# Altium schematic sheet GATE_DRIVER.SchDoc: =DocumentName
size A4; CompanyName: "AS Manufacturing" LLC; Organization: "AS Manufacturing" LLC; Address1: 5 Sklyarenka St.; Address2: Kyiv 04073; Address3: Ukraine; Address4: https://ajax.systems/en/; SheetNumber: 4; SheetTotal: 10; Template_version: 1.0.1
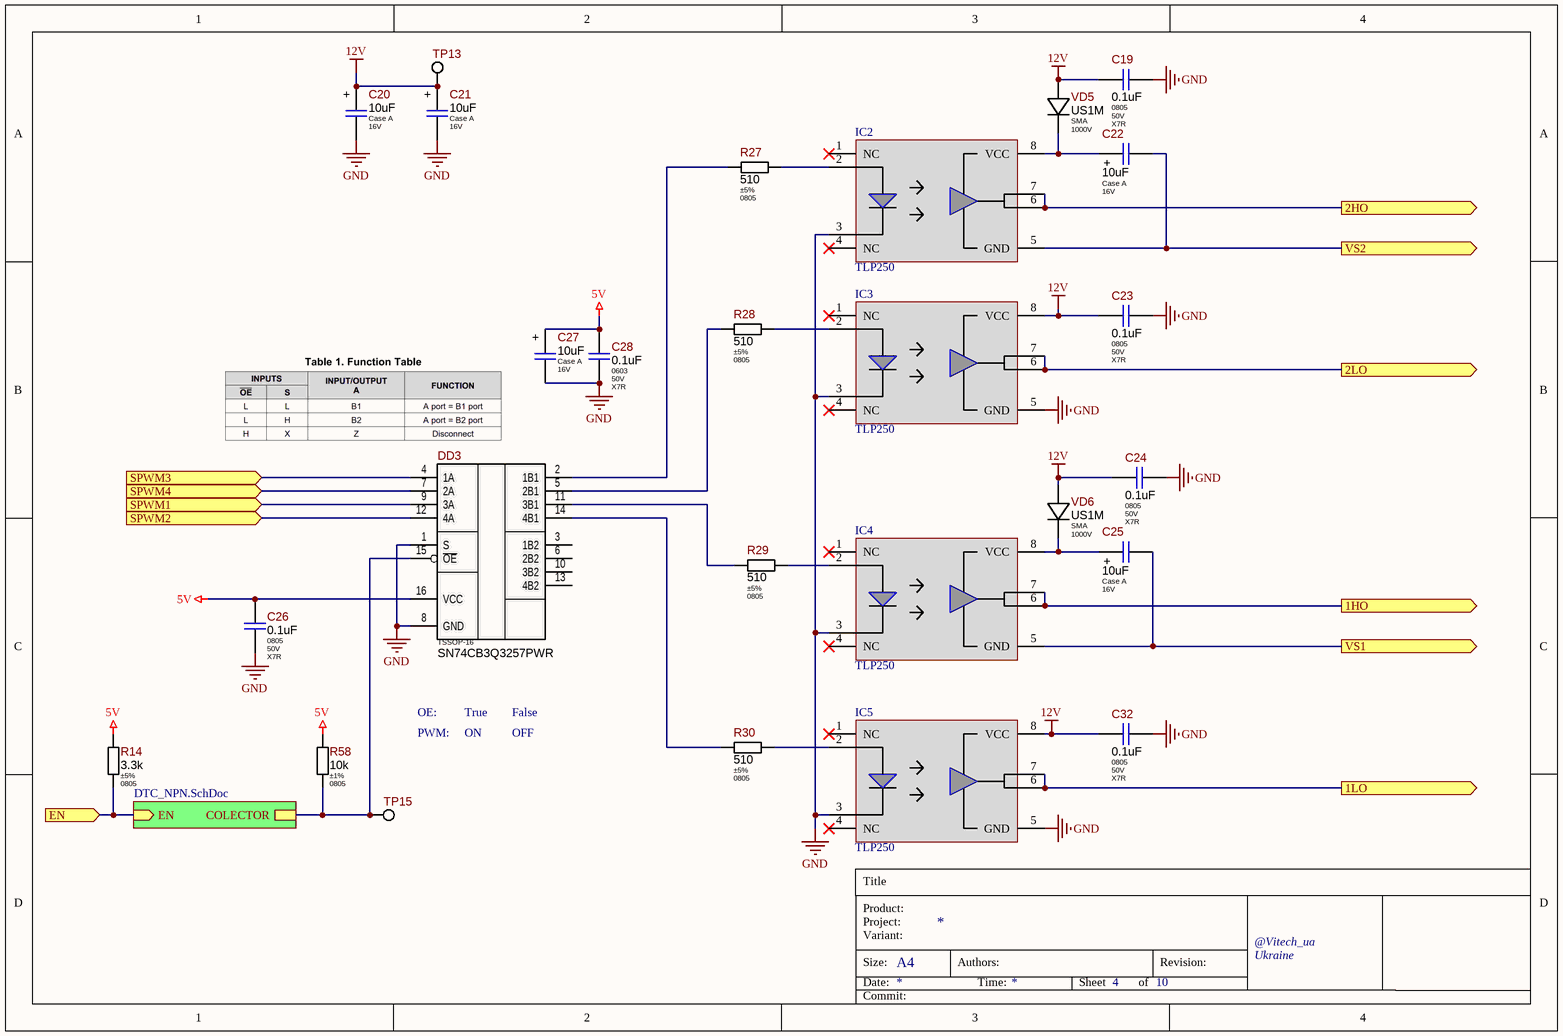
[diagram p0: GATE_DRIVER.SchDoc]

## Parts
C19  Package: 0805  Voltage: 50V  Dielectric Type: X7R  [CAP-0805(2012)X85T10]  (hidden comment: 0.1uF)
C20  Package: Case A  Voltage: 16V  [C_TANTAL_CASE_A_MED]  (hidden comment: 10uF)
C21  Package: Case A  Voltage: 16V  [C_TANTAL_CASE_A_MED]  (hidden comment: 10uF)
C22  Package: Case A  Voltage: 16V  [C_TANTAL_CASE_A_MED]  (hidden comment: 10uF)
C23  Package: 0805  Voltage: 50V  Dielectric Type: X7R  [CAP-0805(2012)X85T10]  (hidden comment: 0.1uF)
C24  Package: 0805  Voltage: 50V  Dielectric Type: X7R  [CAP-0805(2012)X85T10]  (hidden comment: 0.1uF)
C25  Package: Case A  Voltage: 16V  [C_TANTAL_CASE_A_MED]  (hidden comment: 10uF)
C26  Package: 0805  Voltage: 50V  Dielectric Type: X7R  [CAP-0805(2012)X85T10]  (hidden comment: 0.1uF)
C27  Package: Case A  Voltage: 16V  [C_TANTAL_CASE_A_MED]  (hidden comment: 10uF)
C28  Package: 0603  Voltage: 50V  Dielectric Type: X7R  [C_CERAMIC_0603_MED]  (hidden comment: 0.1uF)
C32  Package: 0805  Voltage: 50V  Dielectric Type: X7R  [CAP-0805(2012)X85T10]  (hidden comment: 0.1uF)
DD3  SN74CB3Q3257PWR  [TSSOP-16]
IC2  TLP250  [DIP762W60P254L966H485Q8N]
IC3  TLP250  [DIP762W60P254L966H485Q8N]
IC4  TLP250  [DIP762W60P254L966H485Q8N]
IC5  TLP250  [DIP762W60P254L966H485Q8N]
R14  Tolerance: ±5%  Package: 0805  [R_ANY_CHIP_0805_MED]  (hidden comment: 3.3k)
R27  Tolerance: ±5%  Package: 0805  [R_ANY_CHIP_0805_MED]  (hidden comment: 510)
R28  Tolerance: ±5%  Package: 0805  [R_ANY_CHIP_0805_MED]  (hidden comment: 510)
R29  Tolerance: ±5%  Package: 0805  [R_ANY_CHIP_0805_MED]  (hidden comment: 510)
R30  Tolerance: ±5%  Package: 0805  [R_ANY_CHIP_0805_MED]  (hidden comment: 510)
R58  Tolerance: ±1%  Package: 0805  [R_ANY_CHIP_0805_MED]  (hidden comment: 10k)
TP13  PAD-0.96mm  [PAD-0.96mm]  (value not drawn)  (no BOM)
TP15  PAD-0.96mm  [PAD-0.96mm]  (value not drawn)  (no BOM)
VD5  Package: SMA  Voltage: 1000V  [SMA_MED]  (hidden comment: US1M)
VD6  Package: SMA  Voltage: 1000V  [SMA_MED]  (hidden comment: US1M)

## Sub-sheets
OC = DTC_NPN.SchDoc: EN (in), COLECTOR

## Ports
1HO (out), 1LO (out), 2HO (out), 2LO (out), EN (in), SPWM1 (in), SPWM2 (in), SPWM3 (in), SPWM4 (in), VS1 (out), VS2 (out)

## Nets
5V: C26.1 C27.1 C28.2 DD3.16(VCC) R14.1 R58.2
12V: C19.1 C20.1 C21.1 C23.1 C24.1 C32.1 IC3.8(VCC) IC5.8(VCC) TP13.1 VD5.AN VD6.AN
GND: C19.2 C20.2 C21.2 C23.2 C24.2 C26.2 C27.2 C28.1 C32.2 DD3.1(S) DD3.8(GND) IC2.3(C) IC3.3(C) IC3.5(GND) IC4.3(C) IC5.3(C) IC5.5(GND)
1HO: IC4.6(VO_(OUTPUT)) IC4.7(VO) ; port 1HO
1LO: IC5.6(VO_(OUTPUT)) IC5.7(VO) ; port 1LO
2HO: IC2.6(VO_(OUTPUT)) IC2.7(VO) ; port 2HO
2LO: IC3.6(VO_(OUTPUT)) IC3.7(VO) ; port 2LO
EN: R14.2 ; port EN, sheet OC/EN
SPWM1: DD3.9(3A) ; port SPWM1
SPWM2: DD3.12(4A) ; port SPWM2
SPWM3: DD3.4(1A) ; port SPWM3
SPWM4: DD3.7(2A) ; port SPWM4
VS1: C25.2 IC4.5(GND) ; port VS1
VS2: C22.2 IC2.5(GND) ; port VS2
NetC22_1: C22.1 IC2.8(VCC) VD5.CA
NetC25_1: C25.1 IC4.8(VCC) VD6.CA
NetDD3_2: DD3.2(1B1) R27.1
NetDD3_5: DD3.5(2B1) R28.1
NetDD3_11: DD3.11(3B1) R29.1
NetDD3_14: DD3.14(4B1) R30.1
NetDD3_15: DD3.15(~{OE}) R58.1 TP15.1 ; sheet OC/COLECTOR
NetIC2_2: IC2.2(A) R27.2
NetIC3_2: IC3.2(A) R28.2
NetIC4_2: IC4.2(A) R29.2
NetIC5_2: IC5.2(A) R30.2

Not connected (* = marked no-connect by the designer): DD3 3(1B2) 6(2B2) 10(3B2) 13(4B2); IC2 1(NC)* 4(NC)*; IC3 1(NC)* 4(NC)*; IC4 1(NC)* 4(NC)*; IC5 1(NC)* 4(NC)*

## Notes on the sheet
- OE:
- True
- False
- PWM:
- ON
- OFF
- Title
- Product:
- Project:
- Size:
- Date:
- Variant:
- A4
- Authors:
- Time:
- Sheet
- of
- Revision:
- @Vitech_ua
- Commit:
- (in symbol TAJA106K016RNJ) +

## Library data of the parts
C19 C23 C24 C26 C32 = CL21B104KBCNNNC: 100nF 50V X7R ±10% 0805 Ceramic Capacitor RoHS; Manufacturer: Samsung Electro-Mechanics; Ajax_1C_ID: 1251; Ajax_1C_PN: 100nF 50V X7R 10% 0805 CL21B104KBCNNNC Ceramic Capacitor SMD RoHS; Ajax_1С_Status: Mass Production; Standard Lead Time: 22 Weeks; Component Status: Released; Replacement: NONE; GUID_1C: 2c368b99-dd41-11e0-af93-6c626deda1bb; Value: 0.1uF; Part Number: CL21B104KBCNNNC; Part Type: Ceramic / X7R / 0805; Component Type: SMD; Temperature Range: -55°C ~ 125°C; Tolerance: ±10%; ComponentLink1URL: https://media.digikey.com/pdf/Data%20Sheets/Samsung%20PDFs/CL_Series_MLCC_ds.pdf; Supplier 1: Digi-Key; Supplier Part Number 1: 1276-1003-2-ND; Price: 0,00700031; ComponentLink1Description: Datasheet
C20-C22 C25 C27 = TAJA106K016RNJ: 10uF 16V ±10% Case A Tantalum Capacitors, 3Ohm; Manufacturer: AVX; Ajax_1C_ID: 6332; Ajax_1C_PN: 10uF 16V case A TAJA106K016RNJ-AVX Ceramic Capacitor SMD RoHS; Ajax_1С_Status: RND Only; Standard Lead Time: 25 Weeks; Component Status: Released; Dielectric Type: NONE; GUID_1C: b7f6d7ac-ecab-11e4-ad28-a45d36c4a9e5; Value: 10uF; Part Number: TAJA106K016RNJ; Part Type: Tantalum; Component Type: SMD; Temperature Range: -55°C ~ 125°C; Tolerance: ±10%; ComponentLink1URL: https://eu.mouser.com/datasheet/2/40/AVXC_S_A0011957049_1-2538439.pdf; Supplier 1: Mouser; Supplier Part Number 1: 581-TAJA106K016R; Replacement: NONE; Price: 0,06584713; ComponentLink1Description: Datasheet
C28 = CL10B104KB8NNND: 100nF 50V X7R ±10% 0603 Ceramic Capacitor RoHS; Manufacturer: Samsung Electro-Mechanics; Ajax_1C_ID: 21313; Ajax_1C_PN: 100nF 50V X7R 10% 0603 CL10B104KB8NNND ceramic capacitor SMD; Ajax_1С_Status: Substitution; Standard Lead Time: 18 Weeks; Component Status: Released; Replacement: CL10B104KB8NNNC; GUID_1C: f1fd6399-ca68-11ea-ab63-0050569f2651; Value: 0.1uF; Part Number: CL10B104KB8NNND; Part Type: Ceramic / X7R / 0603; Component Type: SMD; Temperature Range: -55°C ~ 125°C; Tolerance: ±10%; ComponentLink1URL: https://media.digikey.com/pdf/Data%20Sheets/Samsung%20PDFs/CL_Series_MLCC_ds.pdf; Supplier 1: Digi-Key; Supplier Part Number 1: CL10B104KB8NNND-ND; Price: 0,0039378; ComponentLink1Description: Datasheet
DD3 = SN74CB3Q3257PWR: 4-Bit 1-of-2 FET Multiplexer/Demultiplexer 2.5V/3.3V Low-Voltage High-Bandwidth Bus Switch; Manufacturer: Texas Instruments; Ajax_1C_ID: 9738; Ajax_1C_PN: SN74CB3Q3257PWR микросхема; Ajax_1С_Status: RND Only; Standard Lead Time: 8 Weeks; Component Status: Released; Replacement: NONE; GUID_1C: ccf75652-0f3c-11e7-82d9-d8cb8a9acc66; Package: TSSOP-16; Part Number: SN74CB3Q3257PWR; Part Type: Logic / Multiplexer/Demultiplexer; Component Type: SMD; Temperature Range: -40°C ~ 85°C; ComponentLink1URL: http://www.ti.com/lit/ds/symlink/sn74cb3q3257.pdf; Supplier 1: Digi-Key; Supplier Part Number 1: 296-19138-1-ND; Price: 0,337; ComponentLink1Description: Datasheet
IC2-IC5 = TLP250: Integrated Circuit; Manufacturer_Name: Toshiba; Manufacturer_Part_Number: TLP250(F); Datasheet Link: https://pdf.voron.ua/files/pdf/optopara/tlp250.pdf; Height: 4.85mm; Mouser Part Number: 757-TLP250(F); Mouser Price/Stock: https://www.mouser.co.uk/ProductDetail/Toshiba/TLP250F?qs=f0GatGUIxV2cDxQrFeprhQ%3D%3D; Arrow Part Number: TLP250(F); Arrow Price/Stock: https://www.arrow.com/en/products/tlp250-f/toshiba
R14 = RC0805JR-073K3L: 3.3 kOhms ±5%, 1/8W 0805 Thick Film Resistor; Manufacturer: Yageo; Ajax_1C_ID: 9030; Ajax_1C_PN: 3.3k 5% 0805 Resistors SMD RoHS; Ajax_1С_Status: RND Only; Power Rating: 0.125W; Voltage: 150V; Component Status: Released; Temperature Stability: ±100ppm/°C; Replacement: NONE; GUID_1C: cb9785ec-9b47-11e6-8242-d8cb8a9acc66; Value: 3.3k; Part Number: RC0805JR-073K3L; Component Type: SMD; Part Type: Thick Film; Temperature Range: -55°C ~ 155°C; ComponentLink1URL: https://eu.mouser.com/datasheet/2/447/PYu_RC_Group_51_RoHS_L_10-1664068.pdf; Price: 0,001081; ComponentLink1Description: Datasheet
R27-R30 = CRCW0805510RJNEA: 510 Ohms ±5%, 1/8W 0805 Thick Film Resistor; Manufacturer: Vishay; Ajax_1C_ID: 9454; Ajax_1C_PN: 510R 5% 0805 Resistors SMD RoHS; Ajax_1С_Status: RND Only; Power Rating: 0.125W; Voltage: 150V; Component Status: Released; Temperature Stability: ±200ppm/°C; Replacement: NONE; GUID_1C: 51b8dd24-e3a6-11e6-82a2-d8cb8a9acc66; Value: 510; Part Number: CRCW0805510RJNEA; Component Type: SMD; Part Type: Thick Film; Temperature Range: -55°C ~ 155°C; ComponentLink1URL: https://eu.mouser.com/datasheet/2/427/dcrcwe3-1762152.pdf; Supplier 1: Mouser; Supplier Part Number 1: 71-CRCW0805510RJNEA; Price: 0,09; ComponentLink1Description: Datasheet
R58 = RC0805FR-0710K2L: 10 kOhms ±1%, 1/8W 0805 Thick Film Resistor; Manufacturer: Yageo; Ajax_1C_ID: 13943; Ajax_1C_PN: 10.2k 1% 0805 Resistors SMD RoHS; Ajax_1С_Status: Mass Production; Power Rating: 0.125W; Voltage: 150V; Component Status: Released; Temperature Stability: ±100ppm/°C; Replacement: NONE; GUID_1C: 8bc9d0ce-c58a-11e8-ab47-0050569f2651; Value: 10k; Part Number: RC0805FR-0710K2L; Component Type: SMD; Part Type: Thick Film; Temperature Range: -55°C ~ 155°C; ComponentLink1URL: https://eu.mouser.com/datasheet/2/447/PYu_RC_Group_51_RoHS_L_10-1664068.pdf; Supplier 1: Digi-Key; Supplier Part Number 1: 311-10.2KCRTR-ND; Price: 0,0014; ComponentLink1Description: Datasheet
TP13 TP15 = PAD-0.96mm: 0.96mm Pad for Plug-In or Receptacle; Ajax_1C_PN: NONE; Ajax_1С_Status: RND Only; Component Status: Released; Part Number: PAD-0.96mm; Component Type: PTH; Manufacturer: NONE; Part Type: Pad; Temperature Range: NONE; ComponentLink1URL: NONE; Replacement: NONE; Price: NONE; ComponentLink1Description: Datasheet
VD5 VD6 = US1M: Diode Standard 1000V 1A, 75ns, SMA; Manufacturer: Diodec Semiconductor; Ajax_1C_ID: 20461; Ajax_1C_PN: US1M-DIO 1.0A 1000V 75ns, диод; Ajax_1С_Status: Mass Production; Component Status: Released; Vf: 1.7V @ 1A; Replacement: NONE; GUID_1C: 3d137b04-96a6-11ea-ab61-0050569f2651; Part Number: US1M; Part Type: General; Component Type: SMD; Marking: US1M; Current: 1A; Temperature Range: -50°C ~ 150°C; ComponentLink1URL: https://diotec.com/request/datasheet/us1a.pdf; Supplier 1: Arrow; Supplier Part Number 1: US1M; Price: 0,02875902; ComponentLink1Description: Datasheet